# Altium project 3-MainBoard.PrjPcb
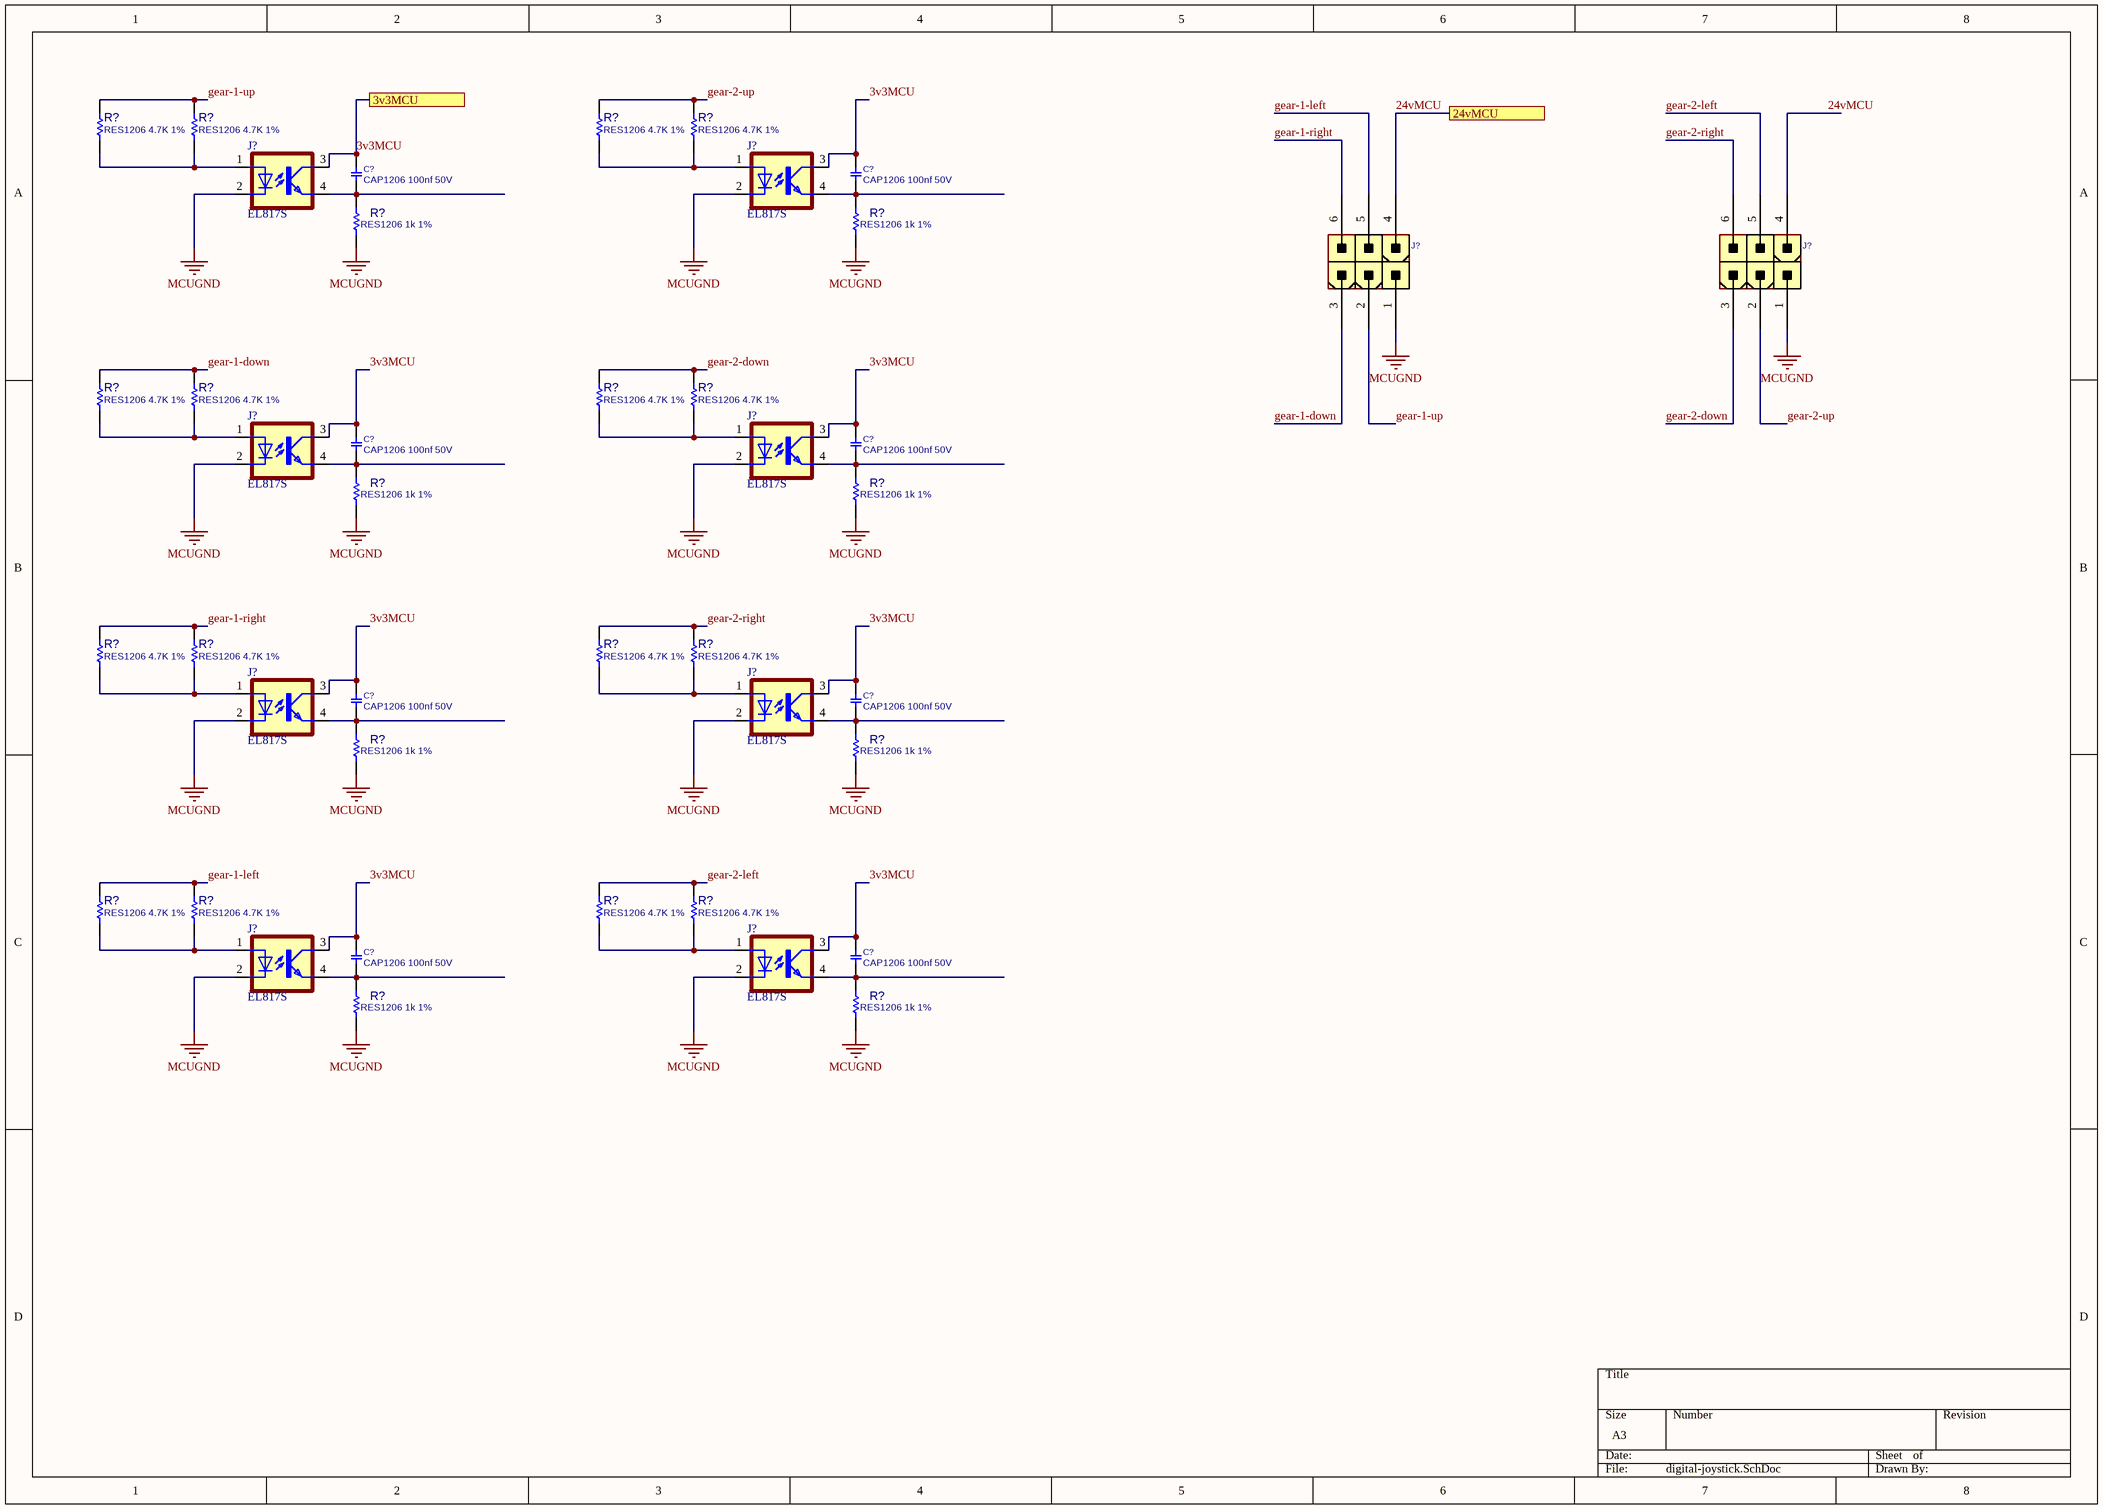
[diagram p0: digital-joystick.SchDoc]
1 sheet, 42 parts. Net scope: flat (ports and power ports of the same name join across sheets).

## Sheet digital-joystick.SchDoc
size A3; SheetNumber: 1; SheetTotal: 1

### Parts
(Parts that share a designator on the sheet are numbered #1, #2 ... from top to bottom, then left to right.)
C?#1  CAP1206 100nf 50V  [C1206]
C?#2  CAP1206 100nf 50V  [C1206]
C?#3  CAP1206 100nf 50V  [C1206]
C?#4  CAP1206 100nf 50V  [C1206]
C?#5  CAP1206 100nf 50V  [C1206]
C?#6  CAP1206 100nf 50V  [C1206]
C?#7  CAP1206 100nf 50V  [C1206]
C?#8  CAP1206 100nf 50V  [C1206]
J?#1  EL817S  [SOIC254P1030X460-4N]
J?#2  EL817S  [SOIC254P1030X460-4N]
J?#3  CONN_ATXPWR_6  [ATXPWR_6]  (value not drawn)
J?#4  CONN_ATXPWR_6  [ATXPWR_6]  (value not drawn)
J?#5  EL817S  [SOIC254P1030X460-4N]
J?#6  EL817S  [SOIC254P1030X460-4N]
J?#7  EL817S  [SOIC254P1030X460-4N]
J?#8  EL817S  [SOIC254P1030X460-4N]
J?#9  EL817S  [SOIC254P1030X460-4N]
J?#10  EL817S  [SOIC254P1030X460-4N]
R?#1  RES1206 4.7K 1%  [R1206]
R?#2  RES1206 4.7K 1%  [R1206]
R?#3  RES1206 4.7K 1%  [R1206]
R?#4  RES1206 4.7K 1%  [R1206]
R?#5  RES1206 1k 1%  [R1206]
R?#6  RES1206 1k 1%  [R1206]
R?#7  RES1206 4.7K 1%  [R1206]
R?#8  RES1206 4.7K 1%  [R1206]
R?#9  RES1206 4.7K 1%  [R1206]
R?#10  RES1206 4.7K 1%  [R1206]
R?#11  RES1206 1k 1%  [R1206]
R?#12  RES1206 1k 1%  [R1206]
R?#13  RES1206 4.7K 1%  [R1206]
R?#14  RES1206 4.7K 1%  [R1206]
R?#15  RES1206 4.7K 1%  [R1206]
R?#16  RES1206 4.7K 1%  [R1206]
R?#17  RES1206 1k 1%  [R1206]
R?#18  RES1206 1k 1%  [R1206]
R?#19  RES1206 4.7K 1%  [R1206]
R?#20  RES1206 4.7K 1%  [R1206]
R?#21  RES1206 4.7K 1%  [R1206]
R?#22  RES1206 4.7K 1%  [R1206]
R?#23  RES1206 1k 1%  [R1206]
R?#24  RES1206 1k 1%  [R1206]

### Ports
3v3MCU, 24vMCU

### Nets
MCUGND: J?#1.2(C) J?#2.2(C) J?#3.1 J?#4.1 J?#5.2(C) J?#6.2(C) J?#7.2(C) J?#8.2(C) J?#9.2(C) J?#10.2(C) R?#5.1 R?#6.1 R?#11.1 R?#12.1 R?#17.1 R?#18.1 R?#23.1 R?#24.1
3v3MCU: C?#1.1 C?#2.1 C?#3.1 C?#4.1 C?#5.1 C?#6.1 C?#7.1 C?#8.1 J?#1.3(COL) J?#2.3(COL) J?#5.3(COL) J?#6.3(COL) J?#7.3(COL) J?#8.3(COL) J?#9.3(COL) J?#10.3(COL) ; port 3v3MCU
24vMCU: J?#3.4 J?#4.4 ; port 24vMCU
gear-1-down: J?#3.3 R?#7.2 R?#8.2
gear-1-left: J?#3.5 R?#19.2 R?#20.2
gear-1-right: J?#3.6 R?#13.2 R?#14.2
gear-1-up: J?#3.2 R?#1.2 R?#2.2
gear-2-down: J?#4.3 R?#9.2 R?#10.2
gear-2-left: J?#4.5 R?#21.2 R?#22.2
gear-2-right: J?#4.6 R?#15.2 R?#16.2
gear-2-up: J?#4.2 R?#3.2 R?#4.2
NetC?#1_2: C?#1.2 J?#1.4(EMIT) R?#5.2
NetC?#2_2: C?#2.2 J?#2.4(EMIT) R?#6.2
NetC?#3_2: C?#3.2 J?#5.4(EMIT) R?#11.2
NetC?#4_2: C?#4.2 J?#6.4(EMIT) R?#12.2
NetC?#5_2: C?#5.2 J?#7.4(EMIT) R?#17.2
NetC?#6_2: C?#6.2 J?#8.4(EMIT) R?#18.2
NetC?#7_2: C?#7.2 J?#9.4(EMIT) R?#23.2
NetC?#8_2: C?#8.2 J?#10.4(EMIT) R?#24.2
NetJ?#1_1: J?#1.1(A) R?#1.1 R?#2.1
NetJ?#2_1: J?#2.1(A) R?#3.1 R?#4.1
NetJ?#5_1: J?#5.1(A) R?#7.1 R?#8.1
NetJ?#6_1: J?#6.1(A) R?#9.1 R?#10.1
NetJ?#7_1: J?#7.1(A) R?#13.1 R?#14.1
NetJ?#8_1: J?#8.1(A) R?#15.1 R?#16.1
NetJ?#9_1: J?#9.1(A) R?#19.1 R?#20.1
NetJ?#10_1: J?#10.1(A) R?#21.1 R?#22.1

### Library data of the parts
C?#1-C?#8 = CAP_SMD_MLCC_1206: CAP, MLCC; PARAM: -, -%; MANF_P#: MANF_PART#; PARAM2: -V; PRICE: 100= 1$; MANF: -; ASSEMBLY: ASSEMBLY
J?#1 J?#2 J?#5-J?#10 = EL817S: Optoisolator Transistor Output 5000Vrms 1 Channel 4-SMD; MF: Everlight Electronics; SnapEDA_Link: https://www.snapeda.com/parts/EL817S/Everlight+Electronics+Co+Ltd/view-part/?ref=snap; Package: SMD-4 Everlight Electronics Co Ltd; Value: *; MP: EL817S; Check_prices: https://www.snapeda.com/parts/EL817S/Everlight+Electronics+Co+Ltd/view-part/?ref=eda
J?#3 J?#4 = CONN_ATXPWR_6: CONN, ATX POWER, 6 P; MANF: TE; MANF_P#: 4-1775099-1; VALUE: CONN_ATXPWR_6; MountType: THD; PACKAGE: ATXPWR-6pin; Part Type: Conn.
R?#1-R?#24 = RES_SMD_1206: RESISTOR, SMD; PARAM: 1%, 0.25W; DESC: DESCRIPTION; DIST#: MOUSER; MANF_P#: -; MANF: -; ASSEMBLY: ASSEMBLY; PRICE: -; PARAM2: -